# EAGLE design at89s52-mc-V0 (EAGLE 5.07)
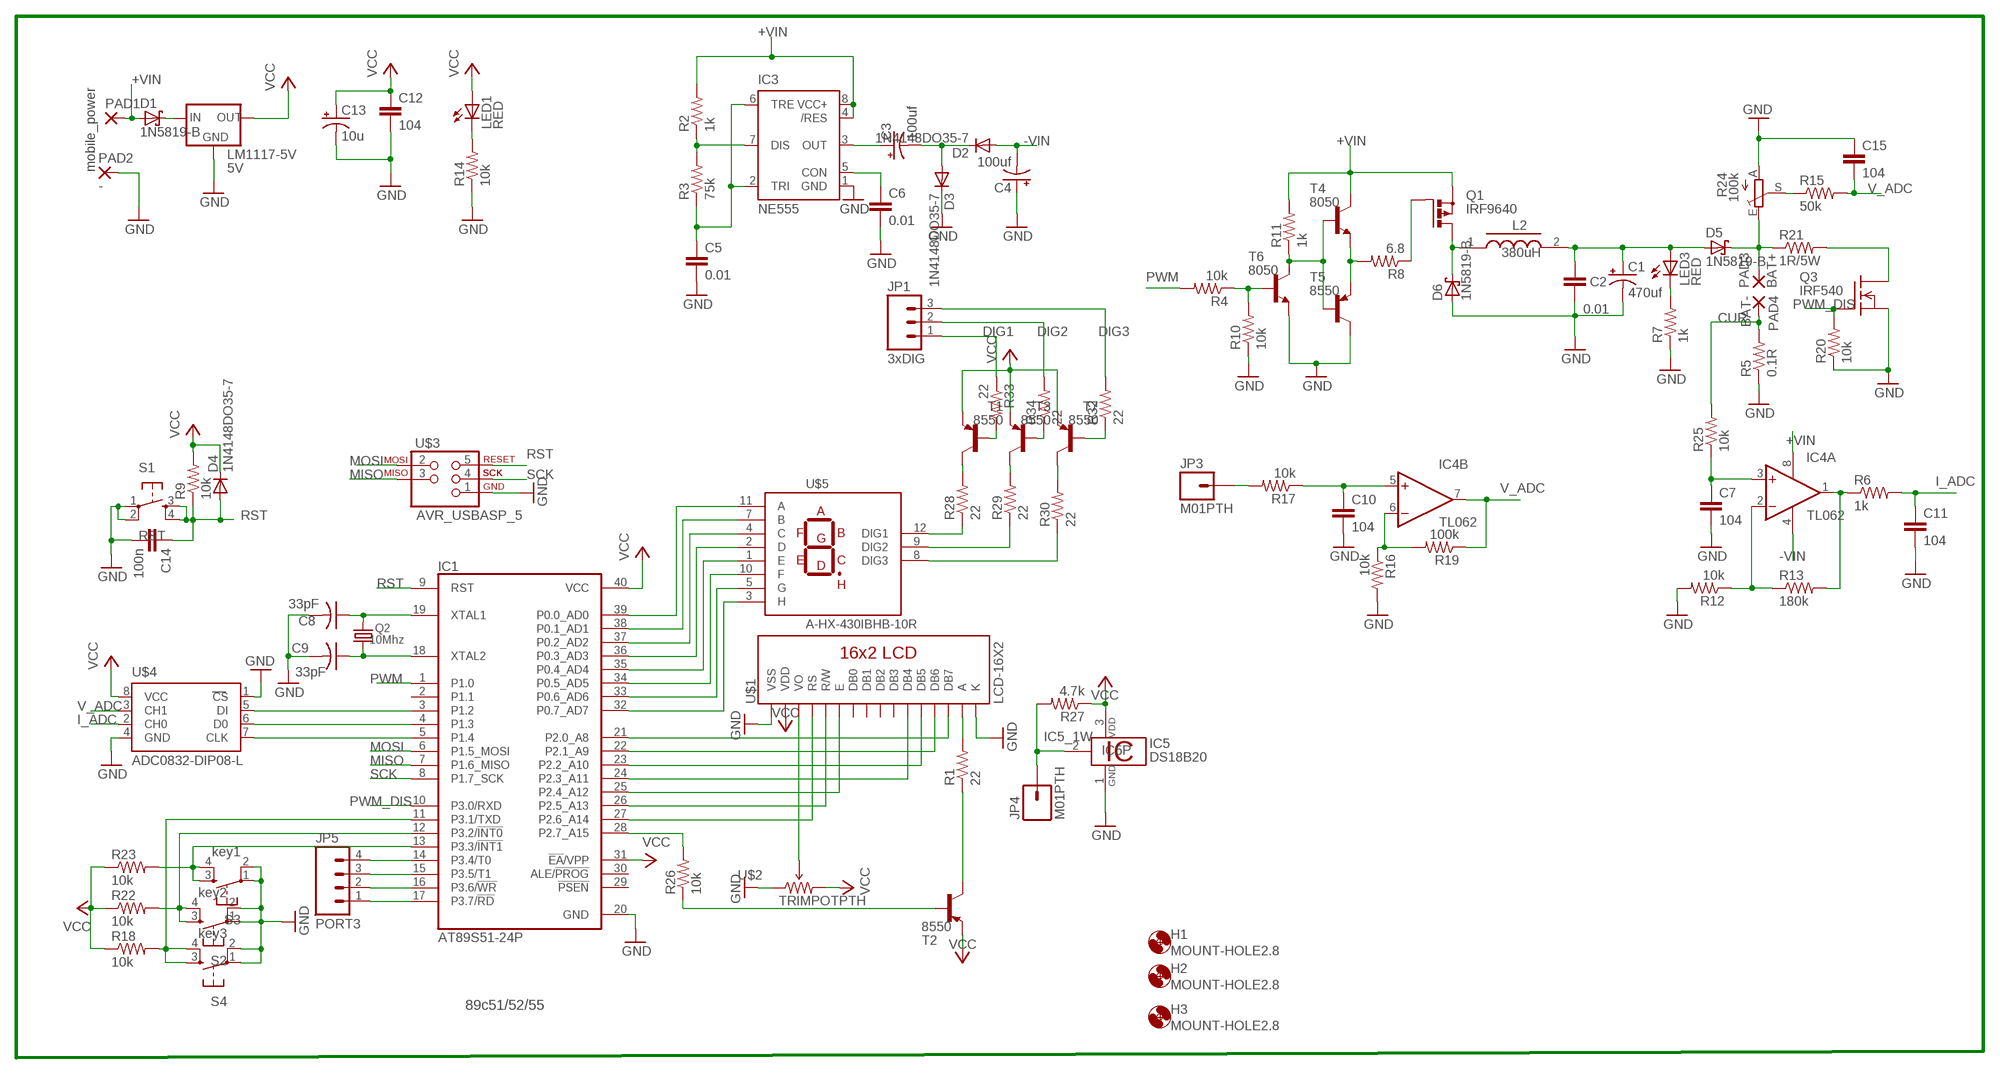
[diagram p0: schematic, sheet 1]

## Parts
C1  470uf  CAP_POLPTH1  [CPOL-RADIAL-100UF-25V]
C2  0.01  CAP0805  [0805]
C3  100uf  CAP_POLPTH1  [CPOL-RADIAL-100UF-25V]
C4  100uf  CAP_POLPTH1  [CPOL-RADIAL-100UF-25V]
C5  0.01  CAP0805  [0805]
C6  0.01  CAP0805  [0805]
C7  104  CAP0805  [0805]
C8  33pF  CAP-2,5  [C-2,5]
C9  33pF  CAP-2,5  [C-2,5]
C10  104  CAP0805  [0805]
C11  104  CAP0805  [0805]
C12  104  CAP0805  [0805]
C13  10u  CAP_POL1206  [EIA3216]
C14  100n  CAP0805  [0805]
C15  104  CAP0805  [0805]
D1  1N5819-B  [DO41-7.6]
D2  1N4148DO35-7  [DO35-7]
D3  1N4148DO35-7  [DO35-7]
D4  1N4148DO35-7  [DO35-7]
D5  1N5819-B  [DO41-7.6]
D6  1N5819-B  [DO41-7.6]
H1  MOUNT-HOLE2.8  [2,8]
H2  MOUNT-HOLE2.8  [2,8]
H3  MOUNT-HOLE2.8  [2,8]
IC1  AT89S51-24P  [DIL40]
IC3  NE555  [DIL-08]
IC4  TL062  [DIP08-L]
IC5  DS18B20  [TO92-]
JP1  3xDIG  M03LOCK  [1X03_LOCK]
JP3  M01PTH  [1X01]
JP4  M01PTH  [1X01]
JP5  PORT3  M04LOCK_LONGPADS  [1X04_LOCK_LONGPADS]
L2  380uH  INDUCTOR-IED16  [ED16]
LED1  RED  LED3MM  [LED3MM]
LED3  RED  LED3MM  [LED3MM]
LM1117-5V  5V  LM1117H  [78XXL]
PAD1  mobile_power  2,54/0,8  [2,54/0,8]
PAD2  -  2,54/0,8  [2,54/0,8]
PAD3  BAT+  2,54/1,1  [2,54/1,1]
PAD4  BAT-  2,54/1,1  [2,54/1,1]
Q1  IRF9640  PMOSFET_PTO220BH  [TO220BH]
Q2  10Mhz  HC18U-V  [HC18U-V]
Q3  IRF540  [TO220]
R1  22  RESISTOR1/4W  [AXIAL-0.3]
R2  1k  RESISTORPTH1  [AXIAL-0.3]
R3  75k  RESISTORPTH1  [AXIAL-0.3]
R4  10k  RESISTORPTH1  [AXIAL-0.3]
R5  0.1R  RESISTOR0414/15  [0414/15]
R6  1k  RESISTOR  [0805]
R7  1k  RESISTOR  [0805]
R8  6.8  RESISTORPTH1  [AXIAL-0.3]
R9  10k  RESISTOR0805  [0805]
R10  10k  RESISTORPTH1  [AXIAL-0.3]
R11  1k  RESISTORPTH1  [AXIAL-0.3]
R12  10k  RESISTOR  [0805]
R13  180k  RESISTOR  [0805]
R14  10k  RESISTOR0805  [0805]
R15  50k  RESISTOR  [0805]
R16  10k  RESISTOR  [0805]
R17  10k  RESISTOR  [0805]
R18  10k  RESISTOR1/4W  [AXIAL-0.3]
R19  100k  RESISTOR  [0805]
R20  10k  RESISTOR  [0805]
R21  1R/5W  RESISTOR0414/15  [0414/15]
R22  10k  RESISTOR1/4W  [AXIAL-0.3]
R23  10k  RESISTOR0805  [0805]
R24  100k  TRIM_EU-B64Y  [B64Y]
R25  10k  RESISTOR  [0805]
R26  10k  RESISTOR0805  [0805]
R27  4.7k  RESISTOR1/4W  [AXIAL-0.3]
R28  22  RESISTOR0805  [0805]
R29  22  RESISTOR0805  [0805]
R30  22  RESISTOR0805  [0805]
R32  22  RESISTOR1/4W  [AXIAL-0.3]
R33  22  RESISTOR1/4W  [AXIAL-0.3]
R34  22  RESISTOR1/4W  [AXIAL-0.3]
S1  RST  TAC_SWITCHPTH  [TACTILE-PTH]
S2  key2  TAC_SWITCHPTH  [TACTILE-PTH]
S3  key1  TAC_SWITCHPTH  [TACTILE-PTH]
S4  key3  TAC_SWITCHPTH  [TACTILE-PTH]
T1  8550  -PNP-TO92-EBC  [TO92-EBC]
T2  8550  -PNP-TO92-EBC  [TO92-EBC]
T3  8550  -PNP-TO92-EBC  [TO92-EBC]
T4  8050  -NPN-TO92-EBC  [TO92-EBC]
T5  8550  -PNP-TO92-EBC  [TO92-EBC]
T6  8050  -NPN-TO92-EBC  [TO92-EBC]
T7  8550  -PNP-TO92-EBC  [TO92-EBC]
U$1  LCD-16X2  [LCD-16X2]
U$2  TRIMPOTPTH  [TRIM_POT_PTH]
U$3  AVR_USBASP_5  [1X5]
U$4  ADC0832-DIP08-L  [DIP08-L]
U$5  A-HX-430IBHB-10R  [A-HX430-30MMX16MM]

## Nets
1W: IC5.2 JP4.1 R27.P$2
+VIN: D1.A IC3.4(/RES) IC3.8(VCC+) IC4.8(P:V+) PAD1.1(P) Q1.S R2.P$2 R11.P$2 T4.C
-VIN: C4.2(-) D2.A IC4.4(P:V-)
CUR: PAD4.1(P) R5.2 R25.2
DIG1: JP1.1 R33.P$1
DIG2: JP1.2 R34.P$2
DIG3: JP1.3 R32.P$2
GND: C1.2(-) C2.2 C4.1(+) C5.2 C6.2 C7.2 C8.2 C9.2 C10.2 C11.2 C12.2 C13.C(-) C14.2 C15.1 D3.C D6.A IC1.20(GND) IC3.1(GND) IC5.1 LM1117-5V.GND PAD2.1(P) Q3.3(S) R5.1 R7.1 R10.P$1 R12.2 R14.1 R16.2 R20.1 R24.A S1.1 S1.2 S2.1 S2.2 S3.1 S3.2 S4.1 S4.2 T5.C T6.E U$1.1(VSS) U$1.16(K) U$2.1(CCW) U$3.1(GND) U$4.1(CS) U$4.4(GND)
I_ADC: C11.1 R6.2 U$4.2(CH0)
MISO: IC1.7(P1.6_MISO) U$3.3
MOSI: IC1.6(P1.5_MOSI) U$3.2
N$1: IC1.27(P2.6_A14) U$1.4(RS)
N$2: IC1.26(P2.5_A13) U$1.5(R/W)
N$3: IC1.25(P2.4_A12) U$1.6(E)
N$4: IC1.24(P2.3_A11) U$1.11(DB4)
N$5: IC1.23(P2.2_A10) U$1.12(DB5)
N$6: IC1.22(P2.1_A9) U$1.13(DB6)
N$7: IC1.21(P2.0_A8) U$1.14(DB7)
N$8: IC3.7(DIS) R2.P$1 R3.P$2
N$10: C5.1 IC3.2(TRI) IC3.6(TRE) R3.P$1
N$11: C6.1 IC3.5(CON)
N$12: C3.1(+) IC3.3(OUT)
N$13: C3.2(-) D2.C D3.A
N$14: C9.1 IC1.18(XTAL2) Q2.1
N$15: U$1.3(VO) U$2.2(WIPER)
N$16: R1.P$2 U$1.15(A)
N$17: LED1.K(C) R14.2
N$18: IC1.28(P2.7_A15) R26.2
N$19: R1.P$1 T2.C
N$21: R4.P$1 R10.P$2 T6.B
N$22: R11.P$1 T4.B T5.B T6.C
N$23: R8.P$2 T4.E T5.E
N$24: LED3.K(C) R7.2
N$25: Q1.G R8.P$1
N$27: IC1.39(P0.0_AD0) U$5.11(A)
N$28: C1.1(+) C2.1 D5.A L2.2 LED3.A
N$29: D6.C L2.1 Q1.D
N$30: D5.C PAD3.1(P) R21.1 R24.E
N$31: IC4.2(A:-IN) R12.1 R13.1
N$32: IC4.1(A:OUT) R6.1 R13.2
N$33: D1.C LM1117-5V.IN
N$34: C8.1 IC1.19(XTAL1) Q2.2
N$35: IC4.6(B:-IN) R16.1 R19.2
N$36: Q3.2(D) R21.2
N$37: IC1.3(P1.2) U$4.5(DI)
N$38: IC1.4(P1.3) U$4.6(D0)
N$39: IC1.5(P1.4) U$4.7(CLK)
N$40: IC1.13(P3.3/!INT1) R23.2 S3.3 S3.4
N$41: IC1.12(P3.2/!INT0) R22.P$2 S2.3 S2.4
N$42: IC1.11(P3.1/TXD) R18.P$2 S4.3 S4.4
N$43: IC1.14(P3.4/T0) JP5.4
N$44: IC1.15(P3.5/T1) JP5.3
N$45: IC1.16(P3.6/!WR) JP5.2
N$46: IC1.17(P3.7/!RD) JP5.1
N$47: IC1.38(P0.1_AD1) U$5.7(B)
N$48: IC1.37(P0.2_AD2) U$5.4(C)
N$49: IC1.36(P0.3_AD3) U$5.2(D)
N$50: IC1.35(P0.4_AD4) U$5.1(E)
N$51: IC1.34(P0.5_AD5) U$5.10(F)
N$52: C10.1 IC4.5(B:+IN) R17.1
N$53: R15.1 R24.S
N$54: C7.1 IC4.3(A:+IN) R25.1
N$55: R26.1 T2.B
N$56: JP3.1 R17.2
N$58: IC1.33(P0.6_AD6) U$5.5(G)
N$59: IC1.32(P0.7_AD7) U$5.3(H)
N$60: R32.P$1 T7.B
N$61: R28.2 T1.C
N$62: R29.2 T3.C
N$63: R30.2 T7.C
N$64: R34.P$1 T3.B
N$65: R33.P$2 T1.B
N$68: R28.1 U$5.12(DIG1)
N$69: R29.1 U$5.9(DIG2)
N$70: R30.1 U$5.8(DIG3)
PWM: IC1.1(P1.0) R4.P$2
PWM_DIS: IC1.10(P3.0/RXD) Q3.1(G) R20.2
RST: C14.1 D4.A IC1.9(RST) R9.1 S1.3 S1.4 U$3.5
SCK: IC1.8(P1.7_SCK) U$3.4
V_ADC: C15.2 IC4.7(B:OUT) R15.2 R19.1 U$4.3(CH1)
VCC: C12.1 C13.A(+) D4.C IC1.31(!EA!/VPP) IC1.40(VCC) IC5.3 LED1.A LM1117-5V.OUT R9.2 R18.P$1 R22.P$1 R23.1 R27.P$1 T1.E T2.E T3.E T7.E U$1.2(VDD) U$2.3(CW) U$4.8(VCC)
Unconnected: IC1.2(P1.1) IC1.29(!PSEN) IC1.30(ALE/!PROG) U$1.7(DB0) U$1.8(DB1) U$1.9(DB2) U$1.10(DB3)

## Notes on the sheet
- 89c51/52/55

## Library data of the parts
C1 C3 C4 C13 = SparkFun:CAP_POL: Capacitor Polarized These are standard SMD and PTH capacitors. Normally 10uF, 47uF, and 100uF in electrolytic and tantalum varieties. Always verify the external diameter of the through hole cap, it varies with capacity, voltage, and manufacturer. The EIA devices should be standard.
C2 C5-C7 C10-C12 C14 C15 = SparkFun:CAP: Capacitor Standard 0603 ceramic capacitor, and 0.1" leaded capacitor.
C8 C9 = DISCRETE:CAP-2,5
D1 D5 D6 = digital-toy:1N581*: 1.0A SCHOTTKY BARRIER RECTIFIER Source: http://www.diodes.com/datasheets/ds23001.pdf
D2-D4 = diode:1N4148: DIODE high speed (Philips)
H1-H3 = holes:MOUNT-HOLE: MOUNTING HOLE with drill center marker
IC1 = atmel:AT89S51-*: 8-bit Microcontroller with 4K BytesIn-System Programmable Flash Source: http://www.atmel.com/dyn/resources/prod_documents/doc2487.pdf
IC3 = st-microelectronics:NE555: General purpose bipolar Timer
IC4 = digital-toy:TL062: Linear Devices dual Operational amplifiers, JFET-Input Stage Input offset voltage:typical 3mV(25C)
IC5 = 1wire:DS18B20: Programmable Resolution Digital Thermometer This chip provides a onewire thermosensor with approx. 0.5°C accuracy. A programmable over/undertemperure alarm is available. The precision can be set from 9..12 bits. Notes: Vdd must be applied for accurate measurements at low temperatures, as the parasite power circuit otherwise heats the sensor. If parasite power is used, Vdd has to be connected to GND. The DS1822 is a low-cost thermometer chip, the DS18S20 is similar to the DS18B20, but with 9 Bit precision only. Author: Jan Kandziora <jjj@gmx.de>
JP1 = SparkFun:M03: Header 3 Standard 3-pin 0.1" header. Use with straight break away headers (SKU : PRT-00116), right angle break away headers (PRT-00553), swiss pins (PRT-00743), machine pins (PRT-00117), and female headers (PRT-00115). Molex polarized connector foot print use with SKU : PRT-08232 with associated crimp pins and housings.
JP3 JP4 = SparkFun:M01: Header 1 Standard 1-pin 0.1" header. Use with straight break away headers (SKU : PRT-00116), right angle break away headers (PRT-00553), swiss pins (PRT-00743), machine pins (PRT-00117), and female headers (PRT-00115).
JP5 = SparkFun:M04: Header 4 Standard 4-pin 0.1" header. Use with straight break away headers (SKU : PRT-00116), right angle break away headers (PRT-00553), swiss pins (PRT-00743), machine pins (PRT-00117), and female headers (PRT-00115). Molex polarized connector foot print use with SKU : PRT-08231 with associated crimp pins and housings.
L2 = digital-toy:INDUCTOR-I: Inductors with Iron
LED1 = LED:LED: LED OSRAM: - CHIPLED LG R971, LG N971, LY N971, LG Q971, LY Q971, LO R971, LY R971 LH N974, LH R974 LS Q976, LO Q976, LY Q976 LO Q996 - Hyper CHIPLED LW Q18S LB Q993, LB Q99A, LB R99A - SideLED LS A670, LO A670, LY A670, LG A670, LP A670 LB A673, LV A673, LT A673, LW A673 LH A674 LY A675 LS A676, LA A676, LO A676, LY A676, LW A676 LS A679, LY A679, LG A679 - Hyper Micro SIDELED® LS Y876, LA Y876, LO Y876, LY Y876 LT Y87S - SmartLED LW L88C, LW L88S LB L89C, LB L89S, LG L890 LS L89K, LO L89K, LY L89K LS L896, LA L896, LO L896, LY L896 - TOPLED LS T670, LO T670, LY T670, LG T670, LP T670 LSG T670, LSP T670, LSY T670, LOP T670, LYG T670 LG T671, LOG T671, LSG T671 LB T673, LV T673, LT T673, LW T673 LH T674 LS T676, LA T676, LO T676, LY T676, LB T676, LH T676, LSB T676, LW T676 LB T67C, LV T67C, LT T67C, LS T67K, LO T67K, LY T67K, LW E67C LS E67B, LA E67B, LO E67B, LY E67B, LB E67C, LV E67C, LT E67C LW T67C LS T679, LY T679, LG T679 LS T770, LO T770, LY T770, LG T770, LP T770 LB T773, LV T773, LT T773, LW T773 LH T774 LS E675, LA E675, LY E675, LS T675 LS T776, LA T776, LO T776, LY T776, LB T776 LHGB T686 LT T68C, LB T68C - Hyper Mini TOPLED® LB M676 - Mini TOPLED Santana® LG M470 LS M47K, LO M47K, LY M47K Source: http://www.osram.convergy.de LUXEON: - LUMILED® LXK2-PW12-R00, LXK2-PW12-S00, LXK2-PW14-U00, LXK2-PW14-V00 LXK2-PM12-R00, LXK2-PM12-S00, LXK2-PM14-U00 LXK2-PE12-Q00, LXK2-PE12-R00, LXK2-PE12-S00, LXK2-PE14-T00, LXK2-PE14-U00 LXK2-PB12-K00, LXK2-PB12-L00, LXK2-PB12-M00, LXK2-PB14-N00, LXK2-PB14-P00, LXK2-PB14-Q00 LXK2-PR12-L00, LXK2-PR12-M00, LXK2-PR14-Q00, LXK2-PR14-R00 LXK2-PD12-Q00, LXK2-PD12-R00, LXK2-PD12-S00 LXK2-PH12-R00, LXK2-PH12-S00 LXK2-PL12-P00, LXK2-PL12-Q00, LXK2-PL12-R00 Source: www.luxeon.com KINGBRIGHT: KA-3528ASYC Source: www.kingbright.com
LED3 = SparkFun:LED: LEDs Standard schematic elements and footprints for 5mm, 3mm, 1206, and 0603 sized LEDs. 5mm - Spark Fun Electronics SKU : COM-00529 (and others)
LM1117-5V = v-reg-2:LM1117
PAD1 PAD2 = wirepad:2,54/0,8: THROUGH-HOLE PAD
PAD3 PAD4 = wirepad:2,54/1,1: THROUGH-HOLE PAD
Q1 = transistor-power:PMOSFET_P: Power MOSFET P-Channel
Q2 = QUARTZ:HC18U-V
Q3 = transistor-fet:IRF540: N-Channel Enhancement MOSFET (HEXFET); 100V; 28A; 0,077Ohm
R1 R5 R9 R14 R18 R21-R23 R26-R30 R32-R34 = digital-toy:RESISTOR: Resistor Basic schematic elements and footprints for 0603, 1206, and PTH 1/10th watt (small) resistors.
R2-R4 R6-R8 R10-R13 R15-R17 R19 R20 R25 = SparkFun:RESISTOR: Resistor Basic schematic elements and footprints for 0603, 1206, and PTH 1/10th watt (small) resistors.
R24 = pot:TRIM_EU-: POTENTIOMETER
S1-S4 = digital-toy:TAC_SWITCH: Momentary Switch Button commonly used for reset or general input. Spark Fun Electronics SKU : COM-00097
T1-T3 T5 T7 = digital-toy:*-PNP-: PNP Transistror
T4 T6 = digital-toy:*-NPN-: NPN Transistror
U$1 = digital-toy:LCD-16X2
U$2 = SparkFun:TRIMPOT
U$3 = digital-toy:AVR_USBASP_5: USBasp minimal pin connector 1x4 pin no GND, does not stable. use this hyl <heyongli@gmail.com>
U$4 = digital-toy:ADC0832: National Semiconductor ADC 0832, 2 channel, 8bit.
U$5 = led-seg:A-HX-430IBHB-10R: Xuyang ShenZhen common anode 3 digit 7 segment led 30mmX16mm 7mm Hight (2.54mm pin) silk name: hx-430ibhb-10r by hyl, heyongli@gmail.com 2010-6-3

## Board
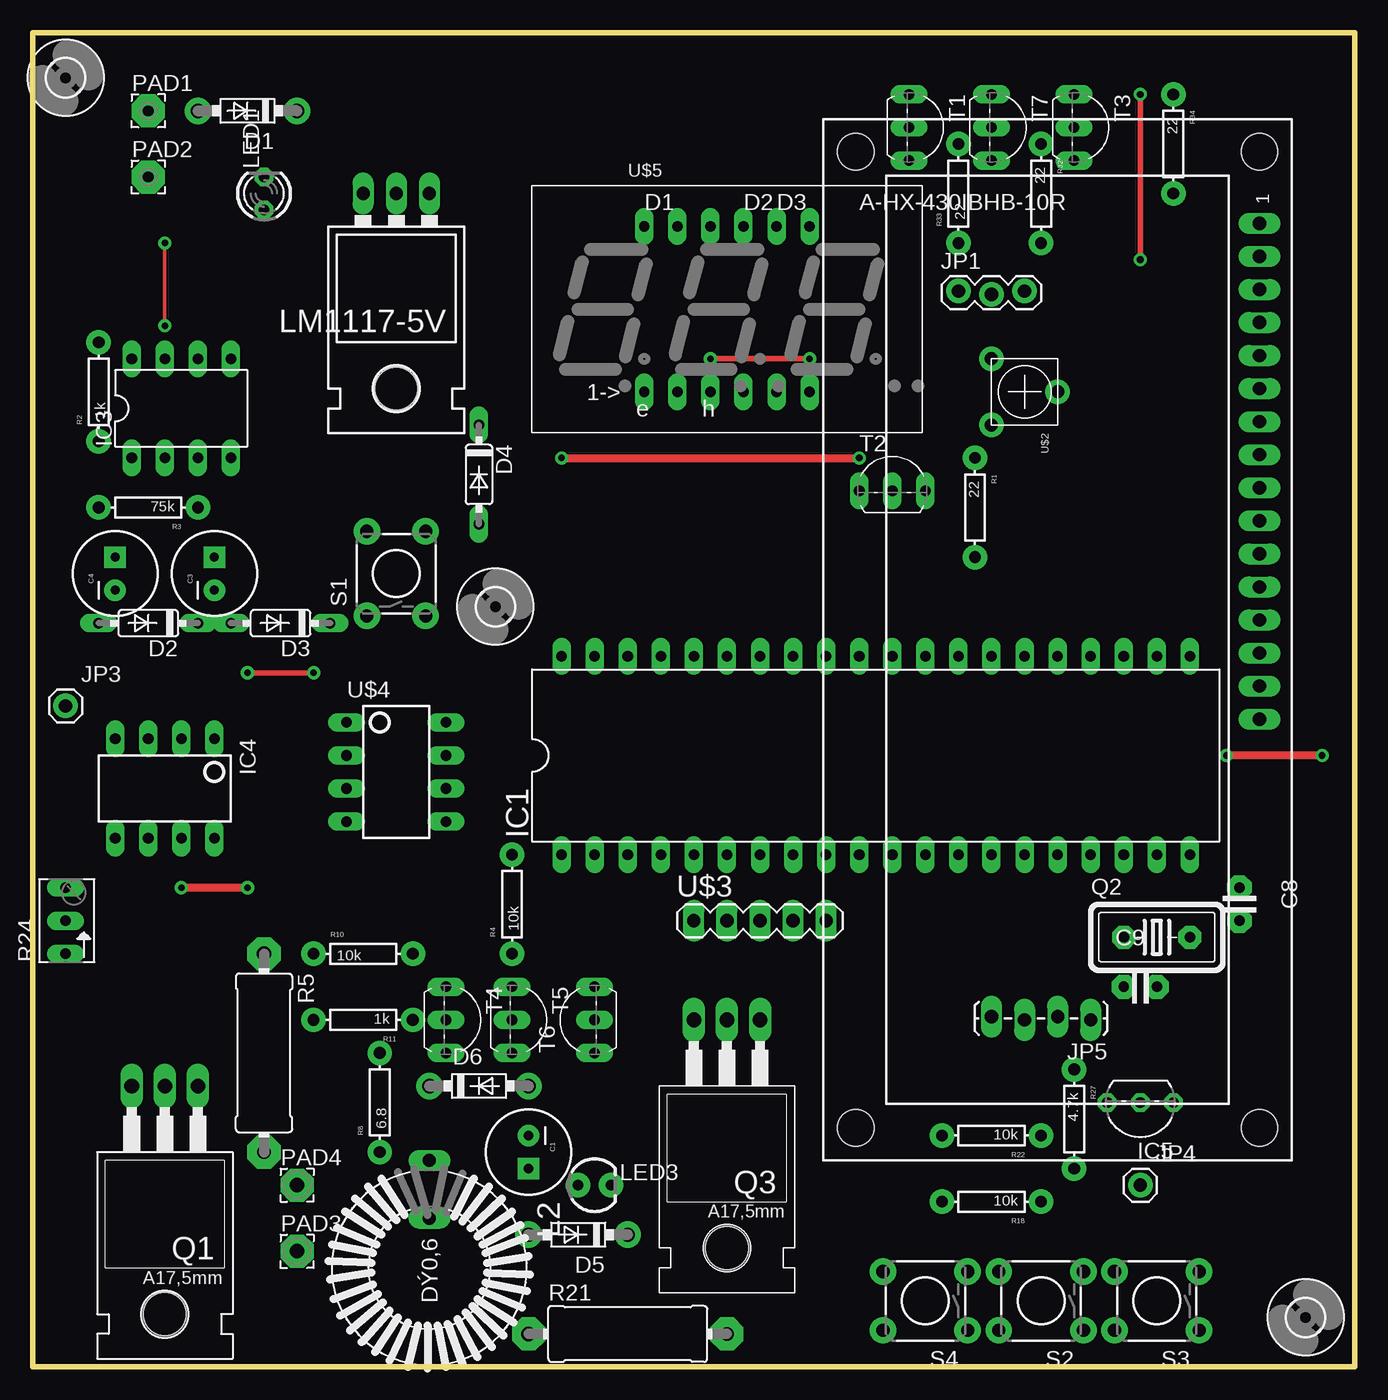
[diagram p1: board, top side]
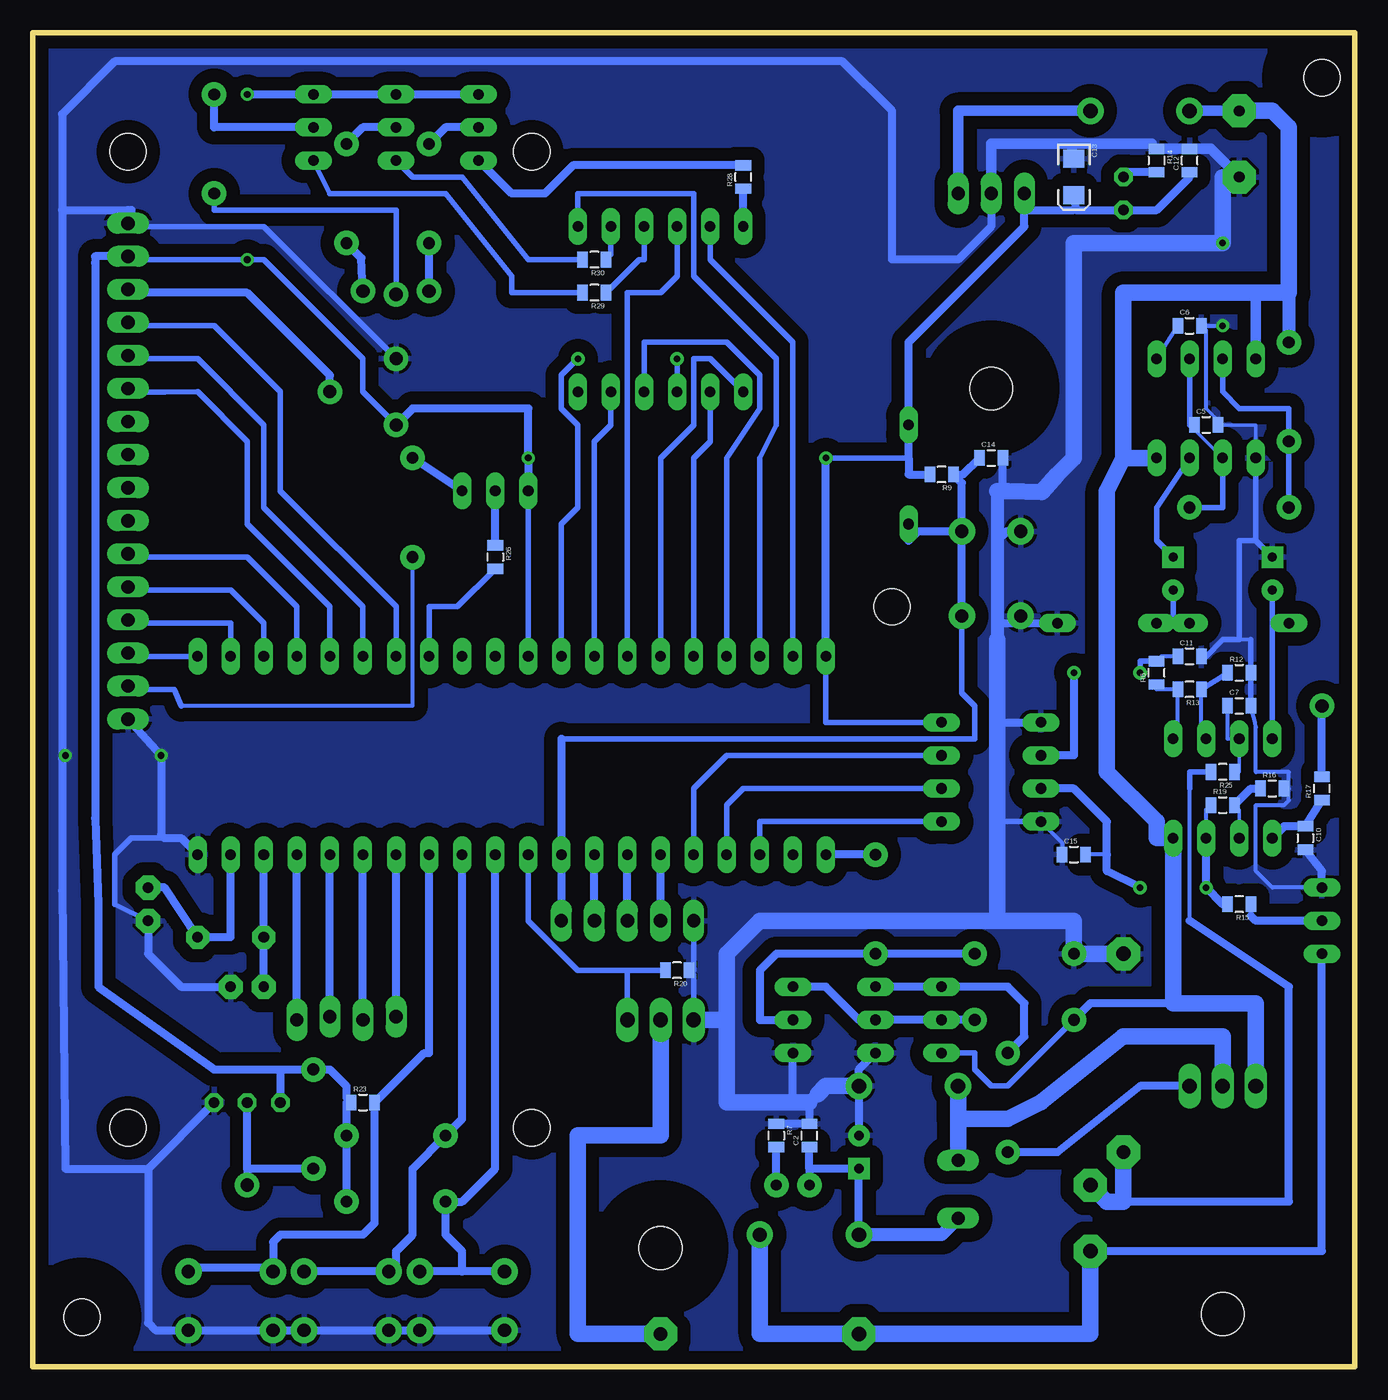
[diagram p2: board, bottom side, seen from below]

Size 101.58 x 102.54 mm. Coordinates in mm from the lower left corner, seen from the top.
Outline: 0,0 101.58,0 101.58,102.54 0,102.54 0,0
Copper layers (1*16): Top 0.035mm / dielectric 1.5mm / Bottom 0.035mm
Design rules "SparkFun": minimum track width 8mil, minimum drill 20mil, track to track 8mil, track to pad 8mil, pad to pad 8mil, via to via 8mil, smd to smd 8mil, copper to edge 10mil, drill to drill 8mil, minimum pad ring 12mil, minimum via ring 10mil, stop-mask expansion 4mil, vias tented up to drill 25mil, thermal gap 10mil

### Footprints (pad centres in the part's own frame; a part is rotated, then mirrored left to right if it is on the bottom)
CPOL-RADIAL-100UF-25V = drill 0.7 pad 1.651 square: 1 1.27,0 | drill 0.7 pad 1.651 round: 2 -1.27,0
0805 = smd 0.8 x 1.2: 1 -0.9,0; 2 0.9,0
C-2,5 = drill 0.8 pad 1.85 octagon: 1 -1.27,0; 2 1.27,0
EIA3216 = smd 1.4 x 1.6: A 1.4,0; C -1.4,0
DO41-7.6 = drill 1.1 pad 2.032 round: A 3.81,0; C -3.81,0
DO35-7 = drill 0.813 long: A 3.81,0; C -3.81,0
2,8 = hole 2.8: 0,0
DIL40 = drill 0.813 long: 1 -24.13,-7.62; 2 -21.59,-7.62; 3 -19.05,-7.62; 4 -16.51,-7.62; 5 -13.97,-7.62; 6 -11.43,-7.62; 7 -8.89,-7.62; 8 -6.35,-7.62; 9 -3.81,-7.62; 10 -1.27,-7.62; 11 1.27,-7.62; 12 3.81,-7.62; 13 6.35,-7.62; 14 8.89,-7.62; 15 11.43,-7.62; 16 13.97,-7.62; 17 16.51,-7.62; 18 19.05,-7.62; 19 21.59,-7.62; 20 24.13,-7.62; 21 24.13,7.62; 22 21.59,7.62; 23 19.05,7.62; 24 16.51,7.62; 25 13.97,7.62; 26 11.43,7.62; 27 8.89,7.62; 28 6.35,7.62; 29 3.81,7.62; 30 1.27,7.62; 31 -1.27,7.62; 32 -3.81,7.62; 33 -6.35,7.62; 34 -8.89,7.62; 35 -11.43,7.62; 36 -13.97,7.62; 37 -16.51,7.62; 38 -19.05,7.62; 39 -21.59,7.62; 40 -24.13,7.62
DIL-08 = drill 0.813 long: 1 -3.81,-3.81; 2 -1.27,-3.81; 3 1.27,-3.81; 4 3.81,-3.81; 5 3.81,3.81; 6 1.27,3.81; 7 -1.27,3.81; 8 -3.81,3.81
DIP08-L = drill 0.813 long: 1 0,-2.54; 2 2.54,-2.54; 3 5.08,-2.54; 4 7.62,-2.54; 5 7.62,5.08; 6 5.08,5.08; 7 2.54,5.08; 8 0,5.08
TO92- = drill 0.813 octagon: 1 -2.54,0; 2 0,0; 3 2.54,0
1X03_LOCK = drill 1.016 pad 1.88 round: 1 0,0.127; 2 2.54,-0.127; 3 5.08,0.127
1X01 = drill 1.016 pad 1.88 round: 1 0,0
1X04_LOCK_LONGPADS = drill 1.016 long: 1 0,0; 2 2.54,-0.254; 3 5.08,0; 4 7.62,-0.254
ED16 = drill 1.016 long: 1 -8.255,0; 2 -3.81,0
LED3MM = drill 0.813 octagon: A -1.27,0; K 1.27,0
LED3MM' = drill 0.813 pad 1.88 round: A -1.27,0; K 1.27,0
78XXL = drill 1.016 long: GND 0,-3.81; IN -2.54,-3.81; OUT 2.54,-3.81 | hole 3.302: 0,11.176
2,54/0,8 = drill 0.813 pad 2.54 octagon: 1 0,0
2,54/1,1 = drill 1.118 pad 2.54 octagon: 1 0,0
TO220BH = drill 1.118 long: D 0,-6.35; G -2.54,-6.35; S 2.54,-6.35 | hole 3.302: 0,11.176
HC18U-V = drill 0.813 pad 1.778 octagon: 1 -2.54,0; 2 2.54,0
TO220 = drill 1.118 long: 1 -2.54,-6.35; 2 0,-6.35; 3 2.54,-6.35 | hole 3.302: 0,11.176
AXIAL-0.3 = drill 0.9 pad 1.88 round: P$1 -3.81,0; P$2 3.81,0
0414/15 = drill 1.1 pad 2.54 octagon: 1 -7.62,0 | drill 1.016 pad 2.54 octagon: 2 7.62,0
B64Y = drill 0.813 long: A 2.54,0; E -2.54,0; S 0,0
TACTILE-PTH = drill 1.016 pad 2.032 round: 1 -3.251,2.261; 2 3.251,2.261; 3 -3.251,-2.261; 4 3.251,-2.261
TO92-EBC = drill 0.813 long: B 0,-1.27; C 2.54,-1.27; E -2.54,-1.27
LCD-16X2 = drill 1.016 long: 1 -32,15.5; 2 -29.46,15.5; 3 -26.92,15.5; 4 -24.38,15.5; 5 -21.84,15.5; 6 -19.3,15.5; 7 -16.76,15.5; 8 -14.22,15.5; 9 -11.68,15.5; 10 -9.14,15.5; 11 -6.6,15.5; 12 -4.06,15.5; 13 -1.52,15.5; 14 1.02,15.5; 15 3.56,15.5; 16 6.1,15.5 | hole 2.8: -37.5,15.5; -37.5,-15.5; 37.5,15.5; 37.5,-15.5
TRIM_POT_PTH = drill 1 pad 1.88 round: 1 -2.54,-2.54; 2 0,2.54; 3 2.54,-2.54
1X5 = drill 1.016 long: 1 0,0; 2 2.54,0; 3 5.08,0; 4 7.62,0; 5 10.16,0
A-HX430-30MMX16MM = drill 0.8 long: 1 -6.35,-6.35; 2 -3.81,-6.35; 3 -1.27,-6.35; 4 1.27,-6.35; 5 3.81,-6.35; 6 6.35,-6.35; 7 6.35,6.35; 8 3.81,6.35; 9 1.27,6.35; 10 -1.27,6.35; 11 -3.81,6.35; 12 -6.35,6.35

### Placement (x,y rotation side)
C1  38.1,16.51 270 top
C2  41.91,17.78 90 bottom
C3  13.97,60.96 90 top
C4  6.35,60.96 90 top
C5  11.43,72.39 0 bottom
C6  12.7,80.01 0 bottom
C7  8.89,50.8 0 bottom
C8  92.71,35.56 270 top
C9  85.09,29.21 0 top
C10  3.81,40.64 270 bottom
C11  12.7,54.61 0 bottom
C12  12.7,92.71 90 bottom
C13  21.59,91.44 270 bottom
C14  27.94,69.85 0 bottom
C15  21.59,39.37 0 bottom
D1  16.51,96.52 180 top
D2  8.89,57.15 180 top
D3  19.05,57.15 180 top
D4  34.29,68.58 270 top
D5  41.91,10.16 180 top
D6  34.29,21.59 0 top
H1  2.54,99.06 0 top
H2  35.56,58.42 0 top
H3  97.79,3.81 0 top
IC1  64.77,46.99 0 top
IC3  11.43,73.66 0 top
IC4  13.97,45.72 180 top
IC5  85.09,20.32 180 top
JP1  71.12,82.55 0 top
JP3  2.54,50.8 0 top
JP4  85.09,13.97 0 top
JP5  81.28,26.67 180 top
L2  30.48,7.62 270 top
LED1  17.78,90.17 90 top
LED3  RED  [LED3MM']  43.18,13.97 0 top
LM1117-5V  27.94,86.36 180 top
PAD1  8.89,96.52 0 top
PAD2  8.89,91.44 0 top
PAD3  20.32,8.89 0 top
PAD4  20.32,13.97 0 top
Q1  10.16,15.24 180 top
Q2  86.36,33.02 0 top
Q3  53.34,20.32 180 top
R1  72.39,66.04 270 top
R2  5.08,74.93 90 top
R3  8.89,66.04 180 top
R4  36.83,35.56 90 top
R5  17.78,24.13 270 top
R6  15.24,53.34 90 bottom
R7  44.45,17.78 270 bottom
R8  26.67,20.32 90 top
R9  31.75,68.58 180 bottom
R10  25.4,31.75 0 top
R11  25.4,26.67 180 top
R12  8.89,53.34 0 bottom
R13  12.7,52.07 180 bottom
R14  15.24,92.71 270 bottom
R15  8.89,35.56 180 bottom
R16  6.35,44.45 0 bottom
R17  2.54,44.45 90 bottom
R18  73.66,12.7 180 top
R19  10.16,43.18 0 bottom
R20  52.07,30.48 180 bottom
R21  45.72,2.54 0 top
R22  73.66,17.78 180 top
R23  76.2,20.32 0 bottom
R24  2.54,34.29 90 top
R25  10.16,45.72 180 bottom
R26  66.04,62.23 270 bottom
R27  80.01,19.05 270 top
R28  46.99,91.44 90 bottom
R29  58.42,82.55 180 bottom
R30  58.42,85.09 180 bottom
R32  77.47,90.17 270 top
R33  71.12,90.17 90 top
R34  87.63,93.98 270 top
S1  27.94,60.96 90 top
S2  77.47,5.08 180 top
S3  86.36,5.08 180 top
S4  68.58,5.08 180 top
T1  68.58,95.25 270 top
T2  66.04,68.58 0 top
T3  81.28,95.25 270 top
T4  33.02,26.67 270 top
T5  38.1,26.67 270 top
T6  41.91,26.67 90 top
T7  74.93,95.25 270 top
U$1  78.74,55.88 270 top
U$2  76.2,74.93 270 top
U$3  50.8,34.29 0 top
U$4  26.67,49.53 270 top
U$5  53.34,81.28 0 top

### Tracks (layer width: path | path; a pad name or v marks a point on that pad's centre or on a via)
1W
  Bottom 0.61: R27.P$2 85.09,15.24 | 85.09,15.24 IC5.2 | 85.09,15.24 JP4.1
+VIN
  Bottom 0.406: R11.P$2 26.67,21.59 27.94,21.59 29.21,22.86 29.21,24.13 T4.C
  Bottom 0.61: R11.P$2 20.32,27.94 13.97,27.94
  Bottom 0.813: 7.62,82.55 IC3.8 | PAD1.1 D1.A
  Bottom 1.016: 5.08,82.55 R2.P$2
  Bottom 1.27: PAD1.1 6.35,96.52 5.08,95.25 5.08,82.55 7.62,82.55 17.78,82.55 17.78,69.85 | 17.78,69.85 IC3.4 | Q1.S 7.62,27.94 13.97,27.94 IC4.8 15.24,40.64 15.24,41.91 19.05,45.72 19.05,67.31 17.78,69.85
-VIN
  Bottom 0.305: 6.35,57.15 D2.A
  Bottom 0.406: IC4.4 6.35,57.15 C4.2
CUR
  Bottom 0.305: 12.7,34.29 12.7,44.45
  Bottom 0.406: R25.2 12.7,45.72 12.7,44.45
  Bottom 0.61: 17.78,12.7 5.08,12.7 5.08,29.21 12.7,34.29
  Bottom 1.27: R5.2 17.78,12.7 19.05,12.7 PAD4.1
DIG1
  Bottom 0.61: JP1.1 R33.P$1
DIG2
  Bottom 0.406: JP1.2 73.66,88.9 87.63,88.9 R34.P$2
DIG3
  Bottom 0.61: JP1.3 76.33,85.22 R32.P$2
GND  (via drill 0.51)
  Top 0.254: v10.16,80.01 v10.16,86.36
  Top 0.61: v99.06,46.99 v91.7,46.99
  Bottom 0.203: 94.24,88.9 93.98,88.9
  Bottom 0.254: C13.C 21.66,92.71 21.29,92.34 | 11.43,73.66 10.16,72.39 7.62,72.39 IC3.1 | 5.08,44.45 R16.2 | 11.43,54.61 C11.2 | 7.99,55.88 8.89,55.88
  Bottom 0.305: v10.16,80.01 C6.2 11.43,79.64 11.43,73.66 | 10.16,72.39 C5.2 | C7.2 7.67,49.53 7.67,49.52 7.62,49.16 7.62,45.72 5.08,45.72 5.08,44.45 5.08,43.55 5.45,43.18 7.62,43.18 7.62,38.1 6.35,36.83 R24.A | C15.1 22.49,40.27 U$4.4 | 91.7,40.9 91.44,40.64 | 99.31,46.74 v99.06,46.99 | R20.1 50.8,30.48
  Bottom 0.406: 7.62,63.5 C4.1 | 7.62,63.5 IC3.1 | 7.99,55.88 R12.2 C7.2 | 7.62,63.5 8.89,63.5 8.89,55.88 10.16,55.88 11.43,54.61 | 27.47,41.91 U$4.4 | Q3.3 50.8,30.11 R20.1 | C8.2 95.25,35.56 95.25,39.37 93.98,40.64 91.44,40.64 | U$2.1 83.82,87.63 93.98,87.63 93.99,87.63 | 50.8,30.48 U$3.1
  Bottom 0.61: C13.C 21.82,93.84 21.96,93.98 | 21.73,93.98 21.66,92.71 | T5.C 38.1,22.86 D6.A C1.2 | 41.91,20.32 C2.2 R7.1 | 43.18,20.32 T6.E | R14.1 15.61,93.98 | 92.71,15.24 99.06,15.24 99.31,36.58 99.31,46.74 99.31,88.9 | 92.71,15.24 92.71,3.38 92.15,2.82 S3.1 S3.2 S2.1 S2.2 S4.1 S4.2 | 27.47,57.15 25.4,57.15 | 25.4,57.15 D3.C | LM1117-5V.GND 27.94,87.63 30.48,85.09 35.56,85.09 35.56,96.52 39.37,100.33 95.25,100.33 99.31,96.27 99.31,88.9 | C10.2 2.54,38.1 R24.A | 92.71,15.24 IC5.1 | S1.2 26.76,64.21 27.47,63.5 | S1.1 25.68,57.43 25.4,57.15 | C14.2 27.04,67.66 26.67,67.29 | C9.2 90.17,29.21 92.71,31.75 C8.2 | 91.44,40.64 90.17,40.64 IC1.20 | 91.7,40.9 v91.7,46.99 U$1.16 | 99.31,88.9 94.24,88.9 | 27.47,49.53 U$4.1 | 93.98,88.9 93.98,87.63 U$1.1
  Bottom 0.813: R14.1 C12.2 11.06,93.61 PAD2.1 | 15.61,93.98 21.73,93.98 | LM1117-5V.GND 27.94,93.98 21.96,93.98
  Bottom 1.016: 41.91,20.32 41.27,20.95 | 27.47,67.31 27.47,63.5 27.47,57.15 27.47,55.88 | 27.47,34.29
  Bottom 1.27: PAD2.1 10.16,91.44 v10.16,86.36 21.59,86.36 21.59,69.85 22.86,68.58 24.08,67.21 26.67,67.29 27.47,67.31 | 41.91,20.32 43.18,20.32 48.26,20.32 48.26,26.67 | D6.A 40.64,21.59 41.27,20.95 | 27.47,55.88 27.47,49.53 27.47,41.91 27.47,34.29 38.1,34.29 45.72,34.29 48.26,31.75 48.26,26.67 | 27.47,34.29 21.59,34.29 R10.P$1 R5.1 | 48.26,26.67 Q3.3
  pour Bottom (isolate 1.016): -2.54,106.68 107.95,106.68 109.22,105.41 109.22,2.54 99.06,-7.62 3.81,-7.62 -5.08,1.27 -5.08,104.14
I_ADC  (via drill 0.51)
  Top 0.406: v16.51,53.34 v21.59,53.34
  Bottom 0.305: C11.1 14.87,54.61 R6.2
  Bottom 0.406: R6.2 16.51,54.24 v16.51,53.34
  Bottom 0.61: v21.59,53.34 21.59,46.99 U$4.2
MISO
  Bottom 0.61: U$3.3 IC1.7
MOSI
  Bottom 0.61: U$3.2 IC1.6
N$1
  Bottom 0.406: IC1.27 73.66,58.42 82.55,67.31 82.55,74.93 87.63,80.01 90.17,80 93.98,80 U$1.4
N$2
  Bottom 0.406: IC1.26 76.2,58.42 83.82,66.04 83.82,72.39 88.9,77.47 91.45,77.47 93.99,77.47 U$1.5
N$3
  Bottom 0.406: IC1.25 78.74,58.42 85.09,64.77 85.09,71.12 88.9,74.93 91.44,74.92 93.98,74.92 U$1.6
N$4
  Bottom 0.406: IC1.24 81.28,58.42 85.09,62.23 93.99,62.23 U$1.11
N$5
  Bottom 0.406: IC1.23 83.82,57.15 86.37,59.69 93.99,59.69 U$1.12
N$6
  Bottom 0.406: IC1.22 86.36,57.15 93.99,57.15 U$1.13
N$7
  Bottom 0.406: IC1.21 90.17,54.6 93.98,54.6 U$1.14
N$8
  Bottom 0.406: IC3.7 10.16,74.93 8.89,73.66 5.08,73.66 R2.P$1 R3.P$2
N$10
  Bottom 0.254: IC3.2 12.7,72.39 C5.1
  Bottom 0.406: 12.7,72.39 IC3.6 | IC3.2 10.16,66.04 R3.P$1
N$11
  Bottom 0.305: C6.1 IC3.5
N$12
  Bottom 0.406: IC3.3 15.24,66.04 15.24,63.5 C3.1
N$13
  Bottom 0.406: D2.C 13.97,57.15 | 13.97,57.15 D3.A | 13.97,57.15 C3.2
N$14
  Bottom 0.61: IC1.18 Q2.1 C9.1
N$15
  Bottom 0.61: U$2.2 78.74,76.2 85.09,82.55 93.99,82.55 U$1.3
N$16
  Bottom 0.305: R1.P$2 72.39,50.8 90.17,50.8
  Bottom 0.406: 90.17,50.8 90.68,52.07 93.99,52.07 U$1.15
N$17
  Bottom 0.61: R14.2 17.41,91.81 LED1.K
N$18
  Bottom 0.406: IC1.28 71.12,55.88 71.12,58.42 68.95,58.42 R26.2
N$19
  Bottom 0.61: T2.C R1.P$1
N$21
  Bottom 0.61: R10.P$2 R4.P$1 44.45,31.75 45.72,30.48 45.72,26.67 T6.B
N$22
  Bottom 0.406: T5.B 38.1,26.67
  Bottom 0.61: 38.1,26.67 40.64,29.21 T6.C | T5.B T4.B R11.P$1
N$23
  Bottom 0.61: T5.E T4.E 26.67,29.21 25.4,27.94 25.4,25.4 R8.P$2
N$24
  Bottom 0.61: LED3.K R7.2
N$25
  Bottom 0.61: Q1.G 16.51,21.59 22.86,16.51 R8.P$1
N$27
  Bottom 0.406: IC1.39 43.18,78.74 49.53,85.09 U$5.11
N$28
  Bottom 0.61: D5.A C1.1 41.91,15.24 | 41.91,15.24 LED3.A | 41.91,15.24 C2.1
  Bottom 1.016: D5.A 31.75,10.16 L2.2
N$29
  Bottom 1.27: 30.48,19.05 L2.1 | 30.48,19.05 D6.C | Q1.D 10.16,25.4 17.78,25.4 24.13,20.32 26.67,19.05 30.48,19.05
N$30
  Bottom 0.61: PAD3.1 2.54,8.89 R24.E
  Bottom 1.27: D5.C 45.72,2.54 R21.1 20.32,2.54 PAD3.1
N$31
  Bottom 0.305: IC4.2 11.8,48.26 R13.1
  Bottom 0.406: R13.1 R12.1
N$32
  Bottom 0.305: IC4.1 13.6,48.26 R13.2 15.24,52.07 R6.1
N$33
  Bottom 0.813: D1.C 30.48,96.52 LM1117-5V.IN
N$34
  Bottom 0.61: IC1.19 86.36,33.02 Q2.2 91.44,36.83 C8.1
N$35
  Bottom 0.254: IC4.6 8.89,42.81 R19.2
  Bottom 0.61: R16.1 7.99,44.45 R19.2
N$36
  Bottom 1.27: R21.2 59.69,2.54 59.69,17.78 53.34,17.78 Q3.2
N$37
  Bottom 0.406: IC1.3 45.72,41.91 U$4.5
N$38
  Bottom 0.406: U$4.6 46.99,44.45 48.26,43.18 IC1.4
N$39
  Bottom 0.406: U$4.7 48.26,46.99 50.8,44.45 IC1.5
N$40
  Bottom 0.406: 88.9,7.62 S3.3 | S3.4 83.82,7.62
  Bottom 0.61: S3.4 83.11,9.6 82.55,10.16 76.2,10.16 75.3,11.06 R23.2 71.49,24.13 71.12,24.13 IC1.13 | 83.82,7.62 88.9,7.62
N$41
  Bottom 0.61: S2.3 S2.4 73.66,7.9 73.66,8.89 72.39,10.16 72.39,15.24 R22.P$2 68.58,19.05 IC1.12
N$42
  Bottom 0.61: S4.4 68.58,7.34 | 68.58,7.34 S4.3 | 68.58,7.34 68.58,8.89 69.85,10.16 R18.P$2 68.58,12.7 66.04,15.24 IC1.11
N$43
  Bottom 0.61: JP5.4 IC1.14
N$44
  Bottom 0.61: JP5.3 IC1.15
N$45
  Bottom 0.61: JP5.2 IC1.16
N$46
  Bottom 0.61: JP5.1 IC1.17
N$47
  Bottom 0.406: IC1.38 45.72,69.85 44.45,72.39 44.45,77.47 50.8,83.82 50.8,90.17 59.69,90.17 U$5.7
N$48
  Bottom 0.406: IC1.37 48.26,69.85 45.72,73.66 45.72,76.2 48.26,78.74 54.61,78.74 U$5.4
N$49
  Bottom 0.406: IC1.36 50.8,69.85 49.53,71.12 U$5.2
N$50
  Bottom 0.406: IC1.35 53.34,69.85 50.8,72.39 50.8,77.47 49.53,77.47 U$5.1
N$51
  Bottom 0.406: IC1.34 55.88,82.55 53.34,82.55 52.07,83.82 U$5.10
N$52
  Bottom 0.61: IC4.5 5.45,41.54 C10.1 R17.1
N$53
  Bottom 0.254: 7.99,34.66 R15.1
  Bottom 0.61: 7.99,34.66 7.62,34.29 R24.S
N$54
  Bottom 0.254: 9.79,48.26 IC4.3 8.89,45.72 R25.1
  Bottom 0.305: 9.79,48.26 C7.1
N$55
  Bottom 0.61: R26.1 T2.B
N$56
  Bottom 0.61: R17.2 JP3.1
N$58
  Bottom 0.406: IC1.33 58.42,71.12 57.15,72.39 U$5.5
N$59  (via drill 0.51)
  Top 0.406: v59.69,77.47 v52.07,77.47
  Bottom 0.406: IC1.32 60.96,64.77 59.69,66.04 59.69,72.39 60.96,73.66 60.96,76.2 v59.69,77.47 | v52.07,77.47 U$5.3
N$60
  Bottom 0.61: T7.B 76.2,95.25 R32.P$1
N$61
  Bottom 0.61: R28.2 60.06,92.34 62.23,90.17 64.77,90.17 T1.C
N$62
  Bottom 0.406: R29.2 64.77,82.55 64.77,83.82 69.85,90.17 78.74,90.17 T3.C
N$63
  Bottom 0.406: R30.2 63.5,85.09 68.58,91.44 72.39,91.44 T7.C
N$64
  Bottom 0.61: T3.B 87.63,95.25 R34.P$1
N$65
  Bottom 0.61: T1.B 69.85,95.25 R33.P$2
N$68
  Bottom 0.61: U$5.12 R28.1
N$69
  Bottom 0.406: U$5.9 54.61,85.09 54.98,85.09 R29.1
N$70
  Bottom 0.406: U$5.8 57.15,85.46 R30.1
PWM
  Bottom 0.61: R4.P$2 IC1.1
PWM_DIS
  Bottom 0.406: 55.88,30.48 Q3.1 | R20.2 55.88,30.48 | IC1.10 63.5,34.29 59.69,30.48 55.88,30.48
RST
  Bottom 0.406: 60.96,48.26 29.21,48.26 29.21,50.8 30.2,51.79 S1.3
  Bottom 0.61: U$3.5 IC1.9 60.96,48.26 | S1.3 S1.4 | S1.4 33.58,64.21 34.29,63.5 D4.A | S1.4 30.2,67.93 R9.1 30.11,68.58 C14.1
SCK
  Bottom 0.61: U$3.4 IC1.8
V_ADC  (via drill 0.51)
  Top 0.61: v11.43,36.83 v16.51,36.83
  Bottom 0.254: R15.2 10.16,35.56
  Bottom 0.305: IC4.7 11.43,41.54 11.43,42.81 R19.1 | 19.05,39.37 C15.2
  Bottom 0.61: 11.43,41.54 v11.43,36.83 10.16,35.56 | v16.51,36.83 19.05,38.1 19.05,39.37 19.05,41.91 21.59,44.45 U$4.3
VCC  (via drill 0.51)
  Top 0.406: v85.09,85.09 v85.09,97.79
  Top 0.61: v40.64,69.85 v63.5,69.85
  Bottom 0.203: R23.1 77.47,20.32 | 93.98,85.09 U$1.2
  Bottom 0.254: C13.A 21.59,88.9 21.45,88.9
  Bottom 0.406: U$4.8 40.64,49.53 IC1.40 | U$2.3 76.2,74.93 76.2,77.47 83.82,85.09 v85.09,85.09 93.98,85.09 93.99,85.09 U$1.2 | 77.47,20.69 R23.1 | v40.64,69.85 34.29,69.85 | T2.E IC1.31
  Bottom 0.61: IC1.40 v40.64,69.85 | C13.A 21.45,88.9 LED1.A 15.24,88.9 12.7,91.44 C12.1 | 25.4,88.9 25.4,87.63 34.29,78.74 D4.C 34.29,69.85 34.29,68.58 R9.2 | 25.4,88.9 21.59,88.9 | R18.P$1 R22.P$1 77.47,20.32 | 82.55,22.86 87.63,22.86 96.52,29.21 96.52,35.56 96.77,42.16 96.77,84.84 96.77,85.34 U$1.2 | 82.55,22.86 R27.P$1 78.74,22.86 77.47,21.59 77.47,20.69 | 25.4,88.9 LM1117-5V.OUT | T2.E v63.5,69.85 63.5,73.66 72.39,73.66 U$2.3 | 82.55,22.86 IC5.3 | T1.E T7.E T3.E v85.09,97.79